# Altium schematic sheet Oscar_MainBoard_Temperature.SchDoc
size A4
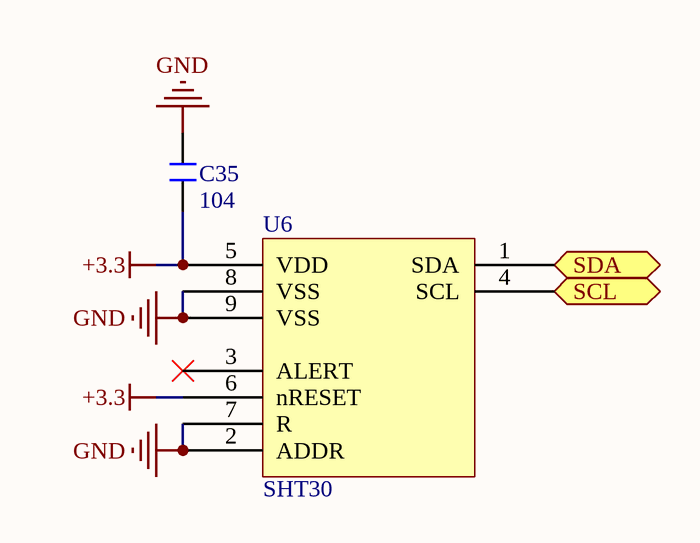
[diagram p0: Oscar_MainBoard_Temperature.SchDoc]

## Parts
C35  104  [C 0402_L]
U6  SHT30  [DFN-8_L2.5-W2.5-P0.50-BL-EP]

## Ports
SCL (in), SDA (bidir)

## Nets
+3.3: C35.1 U6.5(VDD) U6.6(nRESET)
GND: C35.2 U6.2(ADDR) U6.7(R) U6.8(VSS) U6.9(VSS)
SCL: U6.4(SCL) ; port SCL
SDA: U6.1(SDA) ; port SDA

Not connected (* = marked no-connect by the designer): U6 3(ALERT)*

## Library data of the parts
C35 = C: 贴片电容; BOM名称: 无极性贴片电容; 优秀评价可免费更新: 联系淘宝ID：黄晶宝石，获取更新版封装库; 卖家免费技术支持，联系售后: 唯一出售店铺网址https://shop463601444.taobao.com; 本封装库来自淘宝卖家 ID：黄晶宝石: 其他店铺购入均为盗版，请立即申请退款